# Altium project DRV8874 motor driver.PrjPcb
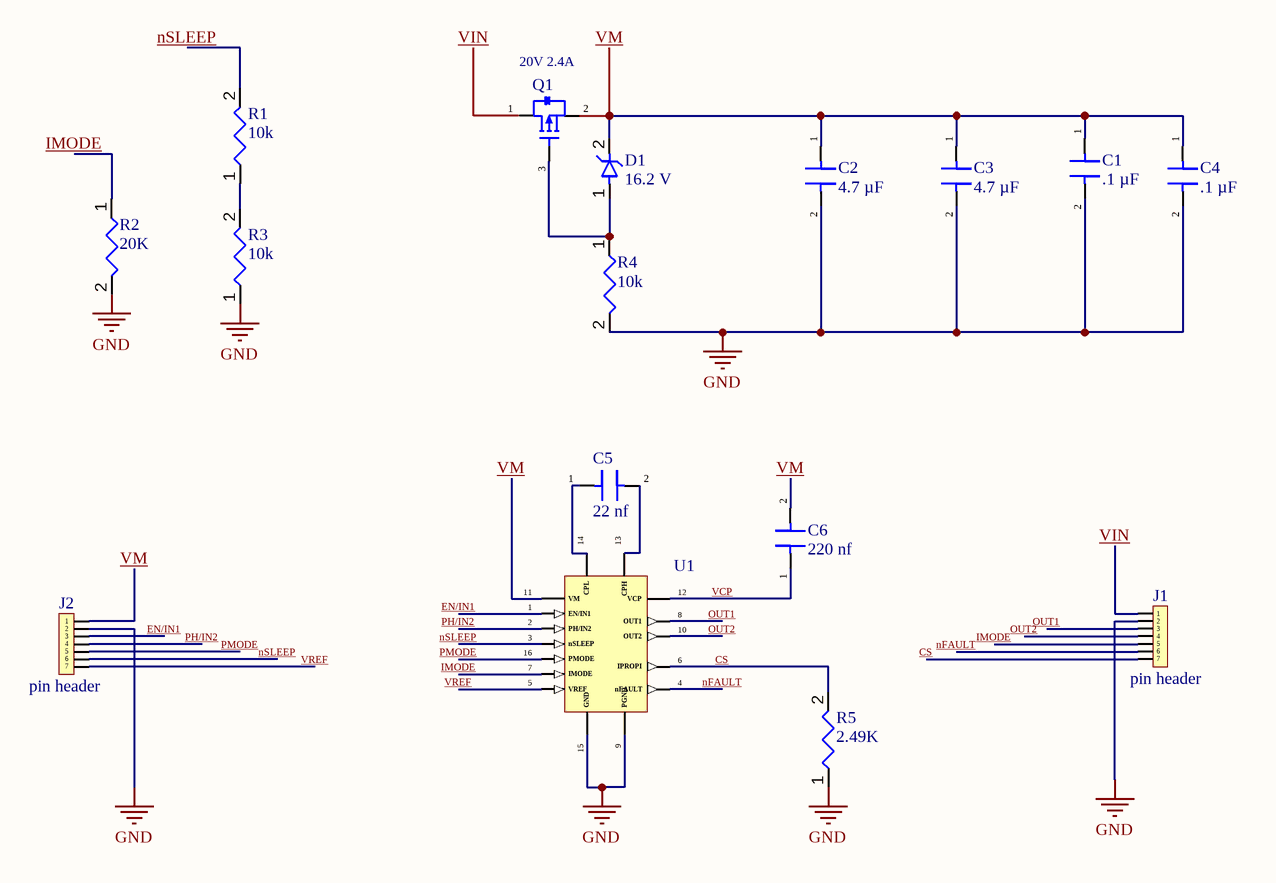
[diagram p0: DRV8874 motor driver.SchDoc]
CAGE_CODE: ?????; CONTRACT_NUMBER: <CONTRACT NO>; DOC_NO_ASSY_DWG: <ASSY DWG NO>; DOC_NO_BOM: <BOM DOC NO>; DOC_NO_FAB_DWG: <FAB DWG NO>; DOC_NO_SCH_DWG: <SCH DWG NO>; PCB_2_DEC_TOL: +/-.01; PCB_3_DEC_TOL: +/-.010; PCB_ANG_TOL: +/-1/2; PCB_ASSEMBLY_NO: <PCB ASSY NO>; PCB_CHECKER: - -----; PCB_CHECKER_APP_DATE: --/--/----; PCB_DESIGNER: - -----; PCB_DESIGNER_APP_DATE: --/--/----; PCB_DWG_NO: <PCB DWG NO>; PCB_ENGINEER: - -----; PCB_ENGINEER_APP_DATE: --/--/----; PCB_PART_NUMBER: <PCB PN>; PCB_REV: A; SCH_REV: A
1 sheet, 16 parts. Net scope: global (net labels, ports and power ports of the same name join across sheets).
Board file: DRV8874 motor driver.PcbDoc

## Sheet DRV8874 motor driver.SchDoc
size 431 x 279 mm; Date: 9/11/2024; CompanyName: Alex Eagles; Engineer: Ahmed Saeed Farrag; SheetNumber: 1; SheetTotal: 1; Project: DRV8874 motor; ENG_APP_DATE: --/--/--; DSN_APP_DATE: --/--/--; CHK_APP_DATE: --/--/--

### Parts
C1  .1 µF  [CAP SMD]
C2  4.7 µF  [CAP SMD]
C3  4.7 µF  [CAP SMD]
C4  .1 µF  [CAP SMD]
C5  22 nf  [CAP SMD]
C6  220 nf  [CAP SMD]
D1  16.2 V  [CAPCP2512X10N]
J1  pin header  [pin header male - duplicate1]
J2  pin header  [pin header male - duplicate1]
Q1  20V 2.4A  [SOTFL95P251X112-3N]
R1  10k  [SMD RESISTOR]
R2  20K  [SMD RESISTOR]
R3  10k  [SMD RESISTOR]
R4  10k  [SMD RESISTOR]
R5  2.49K  [SMD RESISTOR]
U1  https://www.digikey.com/en/products/base-product/texas-instruments/296/DRV8874/21713  [TSOP65P640X120_HS-17N]  (value not drawn)

### Nets
GND: C1.2 C2.2 C3.2 C4.2 J1.2 J2.2 R2.2 R3.1 R4.2 R5.1 U1.9(PGND) U1.15(GND)
CS: J1.7 R5.2 U1.6(IPROPI)
EN/IN1: J2.3 U1.1(EN/IN1)
IMODE: J1.5 R2.1 U1.7(IMODE)
nFAULT: J1.6 U1.4(nFAULT)
nSLEEP: J2.6 R1.2 U1.3(nSLEEP)
OUT1: J1.3 U1.8(OUT1)
OUT2: J1.4 U1.10(OUT2)
PH/IN2: J2.4 U1.2(PH/IN2)
PMODE: J2.5 U1.16(PMODE)
VCP: C6.1 U1.12(VCP)
VIN: J1.1 Q1.1
VM: C1.1 C2.1 C3.1 C4.1 C6.2 D1.2 J2.1 Q1.2 U1.11(VM)
VREF: J2.7 U1.5(VREF)
NetC5_1: C5.1 U1.14(CPL)
NetC5_2: C5.2 U1.13(CPH)
NetD1_1: D1.1 Q1.3 R4.1
NetR1_1: R1.1 R3.2

### Notes on the sheet
- DWG. NO.
- REV.
- SHT.
- THIS DOCUMENT AND THE DATA DISCLOSED HEREIN OR HEREWITH IS THE PROPERTY OF ALTIUM LIMITED AND MAY BE FREELY DISTRIBUTED IN WHOLE. NO RIGHTS ARE RESERVED OR EXPRESS OR IMPLIED WARANTEE GIVEN.
- REVISION
- DESCRIPTION
- DATE
- APPROVED
- ENG:
- APPROVALS
- PROJECT
- DSN:
- CHK:
- REFERENCE DOCUMENTS
- PROJECT REVISION:
- TITLE
- DOCUMENT REVISION:
- DESIGN ITEM:
- BOM:
- FAB DWG:
- PCB DWG:
- ASSY DWG:
- SCALE:
- SIZE
- B
- CAGE CODE
- FILE NAME
- DWG NO.
- SHEET
- OF
- REV

### Library data of the parts
C1-C6 = capacitor smd: 22 µF ±20% 6.3V Ceramic Capacitor X5R 0603 (1608 Metric)
D1 = Zener Diode 16.2 V: Zener Diode 16.2 V 300 mW Surface Mount SOD-323
J1 J2 = pin header 7 positions
Q1 = MOSFET P-CH: P-Channel 20 V 2.4A (Ta) 500mW (Ta) Surface Mount SOT-23-3; Drain to Source Voltage (Vdss): Vgs (Max); Drive Voltage (Max Rds On, Min Rds On): 1.8V, 4.5V; Vgs (Max): ±8V; Current - Continuous Drain (Id) @ 25°C: 2.4A (Ta)
R1-R5 = resistor smd: 10 kOhms ±1% 0.063W, 1/16W Chip Resistor 0402 (1005 Metric) Automotive AEC-Q200, Moisture Resistant Thick Film
U1 = DRV8874 motor driver: DRV8874 H-BRIDGE MOTOR DRIVER; Current - Output: 6A; Voltage - Supply: 0V ~ 5V; Voltage - Load: 4.5V ~ 37V; Applications: Brushed DC; Operating Temperature: -40°C ~ 125°C (TA); Mounting Type: Surface Mount